# Altium schematic sheet pca10090_sheet6_misc.SchDoc: Misc
size A3; Organization: Nordic Semiconductor; DocumentNumber: 6; SheetNumber: 6; SheetTotal: 8; CompanyName: Nordic Semiconductor; DocumentSize: A4
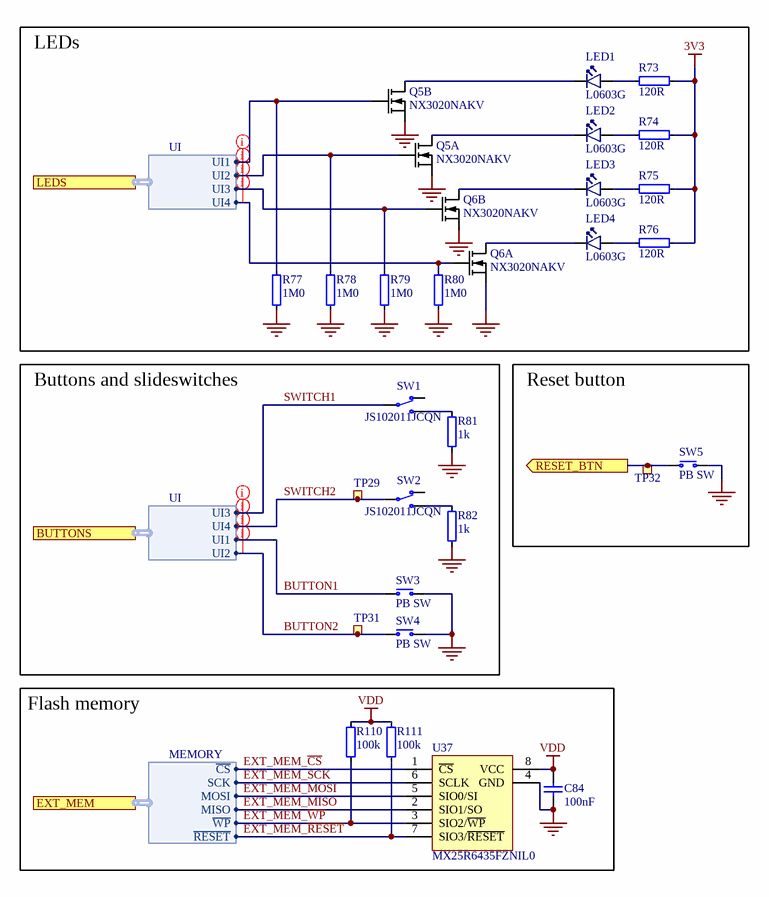
[diagram p0: pca10090_sheet6_misc.SchDoc]

## Parts
C84  100nF  [CAPC0603X03L_C]
LED1  L0603G  [LED_0603_G]
LED2  L0603G  [LED_0603_G]
LED3  L0603G  [LED_0603_G]
LED4  L0603G  [LED_0603_G]
Q5  NX3020NAKV  [NX3020NAKV]  (parts A,B of 2)
Q6  NX3020NAKV  [NX3020NAKV]  (parts A,B of 2)
R73  120R  [RESC0603X03L_C]
R74  120R  [RESC0603X03L_C]
R75  120R  [RESC0603X03L_C]
R76  120R  [RESC0603X03L_C]
R77  1M0  [RESC0603X03L_C]
R78  1M0  [RESC0603X03L_C]
R79  1M0  [RESC0603X03L_C]
R80  1M0  [RESC0603X03L_C]
R81  1k  [RESC0603X03L_C]
R82  1k  [RESC0603X03L_C]
R110  100k  [RESC0603X03L_C]
R111  100k  [RESC0603X03L_C]
SW1  JS102011JCQN  [JS102011JCQN]
SW2  JS102011JCQN  [JS102011JCQN]
SW3  PB SW  [Switch-PB-6.2x6.3mm-SMD]
SW4  PB SW  [Switch-PB-6.2x6.3mm-SMD]
SW5  PB SW  [Switch-PB-6.2x6.3mm-SMD]
TP29  Ø1.5mm,SMD  [TP_SMD_D1.5mm]  (value not drawn)  (no BOM)
TP31  Ø1.5mm,SMD  [TP_SMD_D1.5mm]  (value not drawn)  (no BOM)
TP32  Ø1.5mm,SMD  [TP_SMD_D1.5mm]  (value not drawn)  (no BOM)
U37  MX25R6435FZNIL0  [SON127P600X80_HS-9N]

## Blocks framed on the sheet
LEDs: LED1-LED4 Q5 Q6 R73-R80
Buttons and slideswitches: R81 R82 SW1-SW4 TP29 TP31
Reset button: SW5 TP32
Flash memory: C84 R110 R111 U37

## Ports
BUTTONS (harness UI), EXT_MEM (harness MEMORY), LEDS (harness UI), RESET_BTN (out)

## Harnesses
UI: UI4, UI3, UI2, UI1
MEMORY: SCK, ~{CS}, MOSI, MISO, ~{WP}, ~{RESET}

## Nets
3V3: R73.2 R74.2 R75.2 R76.2
GND: C84.1 Q5.1(S1) Q5.4(S2) Q6.1(S1) Q6.4(S2) R77.1 R78.1 R79.1 R80.1 R81.1 R82.1 SW3.1(N.O) SW4.1(N.O) SW5.1(N.O) U37.4(GND) U37.9(GND)
VDD: C84.2 R110.2 R111.2 U37.8(VCC)
BUTTON1: SW3.2(COM) ; port BUTTONS.UI1
BUTTON2: SW4.2(COM) TP31.1 ; port BUTTONS.UI2
EXT_MEM_~{CS}: U37.1(~{CS}) ; port EXT_MEM.~{CS}
EXT_MEM_MISO: U37.2(SIO1/SO) ; port EXT_MEM.MISO
EXT_MEM_MOSI: U37.5(SIO0/SI) ; port EXT_MEM.MOSI
EXT_MEM_~{RESET}: R111.1 U37.7(SIO3/~{RESET}) ; port EXT_MEM.~{RESET}
EXT_MEM_SCK: U37.6(SCLK) ; port EXT_MEM.SCK
EXT_MEM_~{WP}: R110.1 U37.3(SIO2/~{WP}) ; port EXT_MEM.~{WP}
RESET_BTN: SW5.2(COM) TP32.1 ; port RESET_BTN
SWITCH1: SW1.2(COM) ; port BUTTONS.UI3
SWITCH2: SW2.2(COM) TP29.1 ; port BUTTONS.UI4
NetLED1_1: LED1.1(C) Q5.3(D2)
NetLED1_2: LED1.2(A) R73.1
NetLED2_1: LED2.1(C) Q5.6(D1)
NetLED2_2: LED2.2(A) R74.1
NetLED3_1: LED3.1(C) Q6.3(D2)
NetLED3_2: LED3.2(A) R75.1
NetLED4_1: LED4.1(C) Q6.6(D1)
NetLED4_2: LED4.2(A) R76.1
NetQ5_2: Q5.2(G1) R78.2 ; port LEDS.UI2
NetQ5_5: Q5.5(G2) R77.2 ; port LEDS.UI1
NetQ6_2: Q6.2(G1) R80.2 ; port LEDS.UI4
NetQ6_5: Q6.5(G2) R79.2 ; port LEDS.UI3
NetR81_2: R81.2 SW1.3(N.O)
NetR82_2: R82.2 SW2.3(N.O)

Not connected (* = marked no-connect by the designer): SW1 1(N.C); SW2 1(N.C)

## Layout directives
net class GPIO: BUTTON1, BUTTON2, NetQ5_2, NetQ5_5, NetQ6_2, NetQ6_5, SWITCH1, SWITCH2

## Notes on the sheet
- Title
- Size
- Date:
- A3
- PCB Assembly Number
- Sheet         of
- Revision
- File:
- Drawn By:

## Library data of the parts
C84 = C0201-100n: Capacitor, X5R, ±10%; Manufacturer: N.A.; Part number IPS: 00000001248, 00000002505; Note: 16V; Pad Count: 2; Part Number: C0201-100n; Manufacturer Part Number: N.A.; LatestRevisionDate: 2017-11-09; Published: 2014-11-13; Value: 100nF; Artikkelnr Noca: N.A.; Footprint Doc: 0201; ComponentLink1URL: N.A.; ComponentLink1Description: Datasheet; ComponentLink2URL: N.A.; ComponentLink2Description: Supplier link; HelpURL: N.A.; Supplier 1: N.A.; Supplier Part Number 1: N.A.; Supplier 2: N.A.; Supplier Part Number 2: N.A.; PartId: 100200078; Component Class: Capacitors; Author: rsk; Part number Norautron: N.A.
LED1-LED4 = VS 25C7M5: LED, Green, 0603, 573nm, Vf=2.0V, 24mcd, - 40 to +85°C; Manufacturer: Victory Electronics; Part number IPS: 00000001274, 00000009961; Note: N.A.; Artikkelnr Noca: 13019193; Pad Count: 2; Part Number: VS 25C7M5; Manufacturer Part Number: VS 25C7M5; Footprint Doc: 0603; LatestRevisionDate: 2020-10-23; Published: 2017-08-21; Value: L0603G; ComponentLink1URL: N.A.; ComponentLink1Description: Datasheet; ComponentLink2URL: N.A.; ComponentLink2Description: Supplier link; HelpURL: \\hizz\pro\app9717\Datasheet\optoelectronics\Victory Electronics\VS 25C7M5.pdf; Supplier 1: EC Partner; Supplier Part Number 1: N.A.; Supplier 2: N.A.; Supplier Part Number 2: N.A.; PartId: 101400097; Component Class: Optoelectronics; Author: rsk; Part number Norautron: N.A.
Q5 Q6 = NX3020NAKV: MOSFET 2N-CH 30V 0.2A SOT666; Manufacturer: Nexperia; Manufacturer Part Number: NX3020NAKV,115; Part number IPS: 00000001724; Note: N.A.; Pad Count: 6; Part Number: NX3020NAKV; ComponentLink1URL: https://assets.nexperia.com/documents/data-sheet/NX3020NAKV.pdf; ComponentLink1Description: Datasheet; ComponentLink2URL: N.A.; ComponentLink2Description: Supplier link; HelpURL: N.A.; Footprint Doc: SOT666; LatestRevisionDate: 2018-12-13; Published: 2018-12-13; Value: NX3020NAKV; Supplier 1: Digi-Key; Supplier Part Number 1: 1727-1287-2-ND; Supplier 2: Mouser; Supplier Part Number 2: 771-NX3020NAKV115; Artikkelnr Noca: N.A.; PartId: 101300163; Component Class: Semiconductors; Author: rsk; Part number Norautron: N.A.
R73-R76 = R0201-120: Resistor, ±1%, 0.05W; Manufacturer: N.A.; Part number IPS: 00000000880; Note: Chip Res 1%; Pad Count: 2; Part Number: R0201-120; Manufacturer Part Number: N.A.; ComponentLink1URL: N.A.; ComponentLink1Description: Datasheet; ComponentLink2URL: N.A.; ComponentLink2Description: Supplier link; HelpURL: N.A.; Footprint Doc: 0201; LatestRevisionDate: 2014-11-13; Published: 2014-11-13; Value: 120R; Supplier 1: N.A.; Supplier Part Number 1: N.A.; Supplier 2: N.A.; Supplier Part Number 2: N.A.; Artikkelnr Noca: N.A.; PartId: 100100028; Component Class: Resistors; Author: rsk; Part number Norautron: N.A.
R77-R80 = R0201-1M0: Resistor, ±1%, 0.05W; Manufacturer: N.A.; Part number IPS: 00000001418; Note: Chip Res 1%; Pad Count: 2; Part Number: R0201-1M0; Manufacturer Part Number: N.A.; ComponentLink1URL: N.A.; ComponentLink1Description: Datasheet; ComponentLink2URL: N.A.; ComponentLink2Description: Supplier link; HelpURL: N.A.; Footprint Doc: 0201; LatestRevisionDate: 2014-11-13; Published: 2014-11-13; Value: 1M0; Supplier 1: N.A.; Supplier Part Number 1: N.A.; Supplier 2: N.A.; Supplier Part Number 2: N.A.; Artikkelnr Noca: N.A.; PartId: 100100093; Component Class: Resistors; Author: rsk; Part number Norautron: N.A.
R81 R82 = R0201-1k0: Resistor, ±1%, 0.05W; Manufacturer: N.A.; Part number IPS: 00000005786; Note: Chip Res 1%; Pad Count: 2; Part Number: R0201-1k0; Manufacturer Part Number: N.A.; ComponentLink1URL: N.A.; ComponentLink1Description: Datasheet; ComponentLink2URL: N.A.; ComponentLink2Description: Supplier link; HelpURL: N.A.; Footprint Doc: 0201; LatestRevisionDate: 2014-11-13; Published: 2014-11-13; Value: 1k; Supplier 1: N.A.; Supplier Part Number 1: N.A.; Supplier 2: N.A.; Supplier Part Number 2: N.A.; Artikkelnr Noca: N.A.; PartId: 100100043; Component Class: Resistors; Author: rsk; Part number Norautron: N.A.
R110 R111 = R0201-100k: Resistor, ±1%, 0.05W; Manufacturer: N.A.; Part number IPS: 00000001419; Pad Count: 2; Note: Chip Res 1%; Part Number: R0201-100k; PartId: 100100080; Component Class: Resistors; Author: rsk; Manufacturer Part Number: N.A.; ComponentLink1URL: N.A.; ComponentLink1Description: Datasheet; ComponentLink2URL: N.A.; ComponentLink2Description: Supplier link; HelpURL: N.A.; Footprint Doc: 0201; LatestRevisionDate: 2014-11-13; Published: 2014-11-13; Value: 100k; Supplier 1: N.A.; Supplier Part Number 1: N.A.; Supplier 2: N.A.; Supplier Part Number 2: N.A.; Artikkelnr Noca: N.A.; Part number Norautron: N.A.
SW1 SW2 = JS102011JCQN: Sub-Miniature Slide Switch, SPDT, 300mA, 6V, Vertical, SMD; Manufacturer: C&K; Part number IPS: 00000009980; Note: N.A.; Pad Count: 3; Part Number: JS102011JCQN; Manufacturer Part Number: JS102011JCQN; LatestRevisionDate: 2020-10-23; Published: 2017-02-15; Value: JS102011JCQN; Artikkelnr Noca: N.A.; ComponentLink1URL: https://www.ckswitches.com/media/1422/js.pdf; ComponentLink1Description: Datasheet; ComponentLink2URL: https://www.digikey.com/en/products/detail/c-k/JS102011JCQN/6137628; ComponentLink2Description: Supplier link; HelpURL: https://www.ckswitches.com/products/switches/product-details/Slide/JS/JS102011JCQN/; Footprint Doc: JS102011JCQN; Supplier 1: Digi-Key; Supplier Part Number 1: CKN10721CT-ND; Supplier 2: Mouser; Supplier Part Number 2: 611-JS102011JCQN; PartId: 101500055; Component Class: Switches; Author: rsk; Part number Norautron: N.A.
SW3-SW5 = Switch-PB-6.2x6.3mm-SMD: Tactile Switch, SPNO, SMD, 160gf, 6.2x6.3x2.5mm; Manufacturer: Dailywell; Manufacturer Part Number: TS604VM1-025BR-R; Part number IPS: 00000007812; Note: N.A.; Artikkelnr Noca: 50019106; Pad Count: 4; Part Number: Switch-PB-6.2x6.3mm-SMD; Footprint Doc: Switch-PB-6.2x6.3mm-SMD; LatestRevisionDate: 2016-04-21; Published: 2010-02-01; Value: PB SW; ComponentLink1URL: N.A.; ComponentLink1Description: Datasheet; ComponentLink2URL: N.A.; ComponentLink2Description: Supplier link; HelpURL: \\hizz\pro\app9717\Datasheet\switches\Dailywell\TS604VM1-025BR-R.pdf; Supplier 1: Cabcon; Supplier Part Number 1: TS604VM1-025BR-R; Supplier 2: Mouser; Supplier Part Number 2: 688-SKHUALE010; PartId: 101500001; Component Class: Switches; Author: rsk; Part number Norautron: N.A.
TP29 TP31 TP32 = TP_SMD_Ø1.5MM: 1.5mm circular SMD testpad; Manufacturer: Nordic Semiconductor; Manufacturer Part Number: N.A.; Pad Count: 1; Part Number: TP_SMD_Ø1.5MM; ComponentLink1URL: N.A.; ComponentLink1Description: Datasheet; ComponentLink2URL: N.A.; ComponentLink2Description: Supplier link; HelpURL: N.A.; Footprint Doc: TP_SMD_Ø1.5mm; LatestRevisionDate: 2021-03-05; Published: 2016-06-02; Value: Ø1.5mm,SMD; Note: N.A.; Artikkelnr Noca: N.A.; Part number IPS: N.A.; Supplier 1: N.A.; Supplier Part Number 1: N.A.; Supplier 2: N.A.; Supplier Part Number 2: N.A.; PartId: 100500477; Component Class: Connectors; Author: rsk; Part number Norautron: N.A.
U37 = MX25R6435FZNIL0: Ultra low power, 64M-bit, serial multi I/O flash memory; Manufacturer: Macronix; Part number IPS: 00000004370; Note: N.A.; Artikkelnr Noca: 15020015; Pad Count: 8; Part Number: MX25R6435FZNIL0; Manufacturer Part Number: MX25R6435FZNIL0; Footprint Doc: WSON-8; LatestRevisionDate: 2021-02-26; Published: 2016-06-29; Value: MX25R6435F; ComponentLink1URL: N.A.; ComponentLink1Description: Datasheet; ComponentLink2URL: N.A.; ComponentLink2Description: Supplier link; HelpURL: https://www.macronix.com/Lists/Datasheet/Attachments/7913/MX25R6435F,%20Wide%20Range,%2064Mb,%20v1.5.pdf; Supplier 1: Future; Supplier Part Number 1: MX25R6435FZNIL0; Supplier 2: Arrow; Supplier Part Number 2: MX25R6435FZNIL0; PartId: 101900438; Component Class: Misc_ICs; Author: rsk; Part number Norautron: N.A.